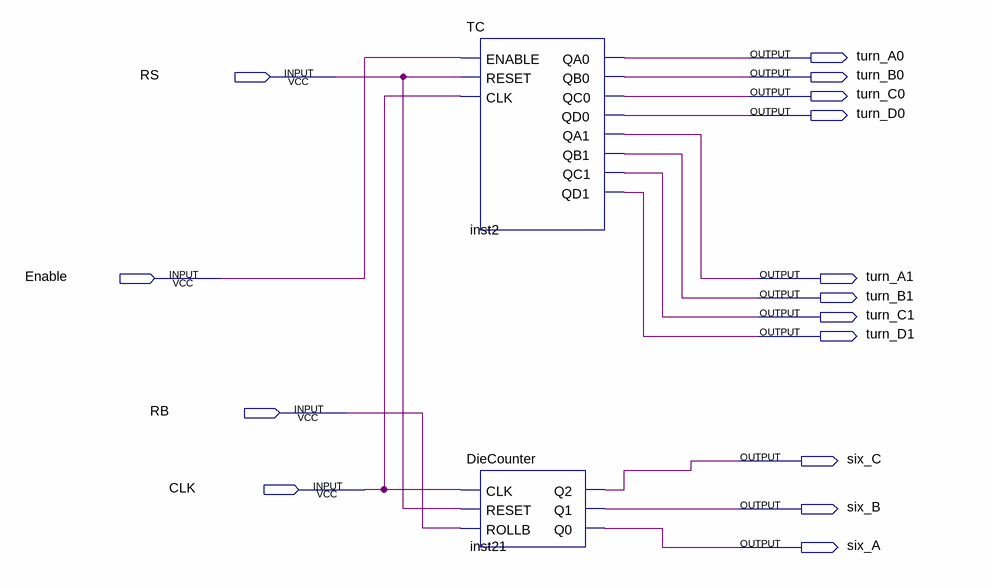
[diagram p0: schematic sheet]
// Quartus schematic TDCounter.bdf as structural Verilog: 2 symbols, 15 pins
module TDCounter (
  input  RS,
  input  Enable,
  input  RB,
  input  CLK,
  output turn_A0,
  output turn_B0,
  output turn_C0,
  output turn_D0,
  output turn_A1,
  output turn_B1,
  output turn_C1,
  output turn_D1,
  output six_C,
  output six_B,
  output six_A
);

  TC inst2 (
    .ENABLE(Enable), .RESET(RS), .CLK(CLK), .QA0(turn_A0), .QB0(turn_B0), .QC0(turn_C0), .QD0(turn_D0),
    .QA1(turn_A1), .QB1(turn_B1), .QC1(turn_C1), .QD1(turn_D1));
  DieCounter inst21 (.CLK(CLK), .RESET(RS), .ROLLB(RB), .Q2(six_C), .Q1(six_B), .Q0(six_A));
endmodule
